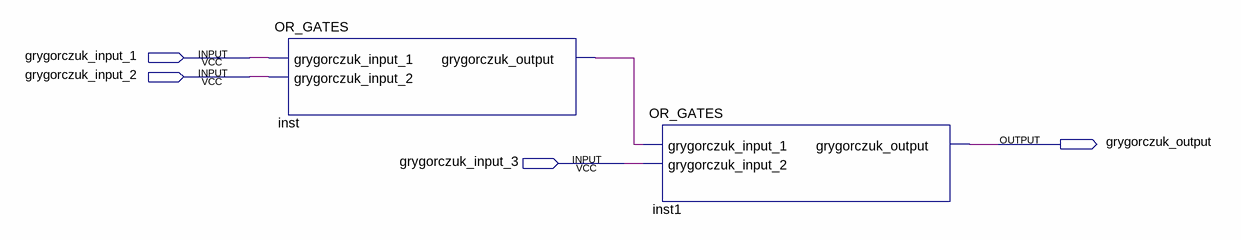
[diagram p0: schematic sheet]
// Quartus schematic THREE_PIN_OR_GATES.bdf as structural Verilog: 2 symbols, 4 pins
module THREE_PIN_OR_GATES (
  input  grygorczuk_input_1,
  input  grygorczuk_input_2,
  input  grygorczuk_input_3,
  output grygorczuk_output
);

  wire inst_grygorczuk_output;

  OR_GATES inst (
    .grygorczuk_input_1(grygorczuk_input_1), .grygorczuk_input_2(grygorczuk_input_2),
    .grygorczuk_output(inst_grygorczuk_output));
  OR_GATES inst1 (
    .grygorczuk_input_1(inst_grygorczuk_output), .grygorczuk_input_2(grygorczuk_input_3),
    .grygorczuk_output(grygorczuk_output));
endmodule
